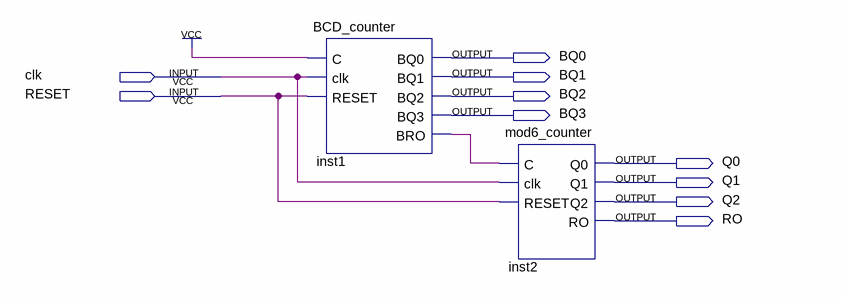
[diagram p0: schematic sheet]
// Quartus schematic mod60Counter.bdf as structural Verilog: 2 symbols, 10 pins
module mod60Counter (
  input  clk,
  input  RESET,
  output BQ0,
  output BQ1,
  output BQ2,
  output BQ3,
  output Q0,
  output Q1,
  output Q2,
  output RO
);

  wire inst1_bro;

  BCD_counter inst1 (.C(1'b1), .clk(clk), .RESET(RESET), .BQ0(BQ0), .BQ1(BQ1), .BQ2(BQ2), .BQ3(BQ3), .BRO(inst1_bro));
  mod6_counter inst2 (.C(inst1_bro), .clk(clk), .RESET(RESET), .Q0(Q0), .Q1(Q1), .Q2(Q2), .RO(RO));
endmodule
